# EAGLE schematic Arctos 65 V1 (EAGLE 9.6.2)
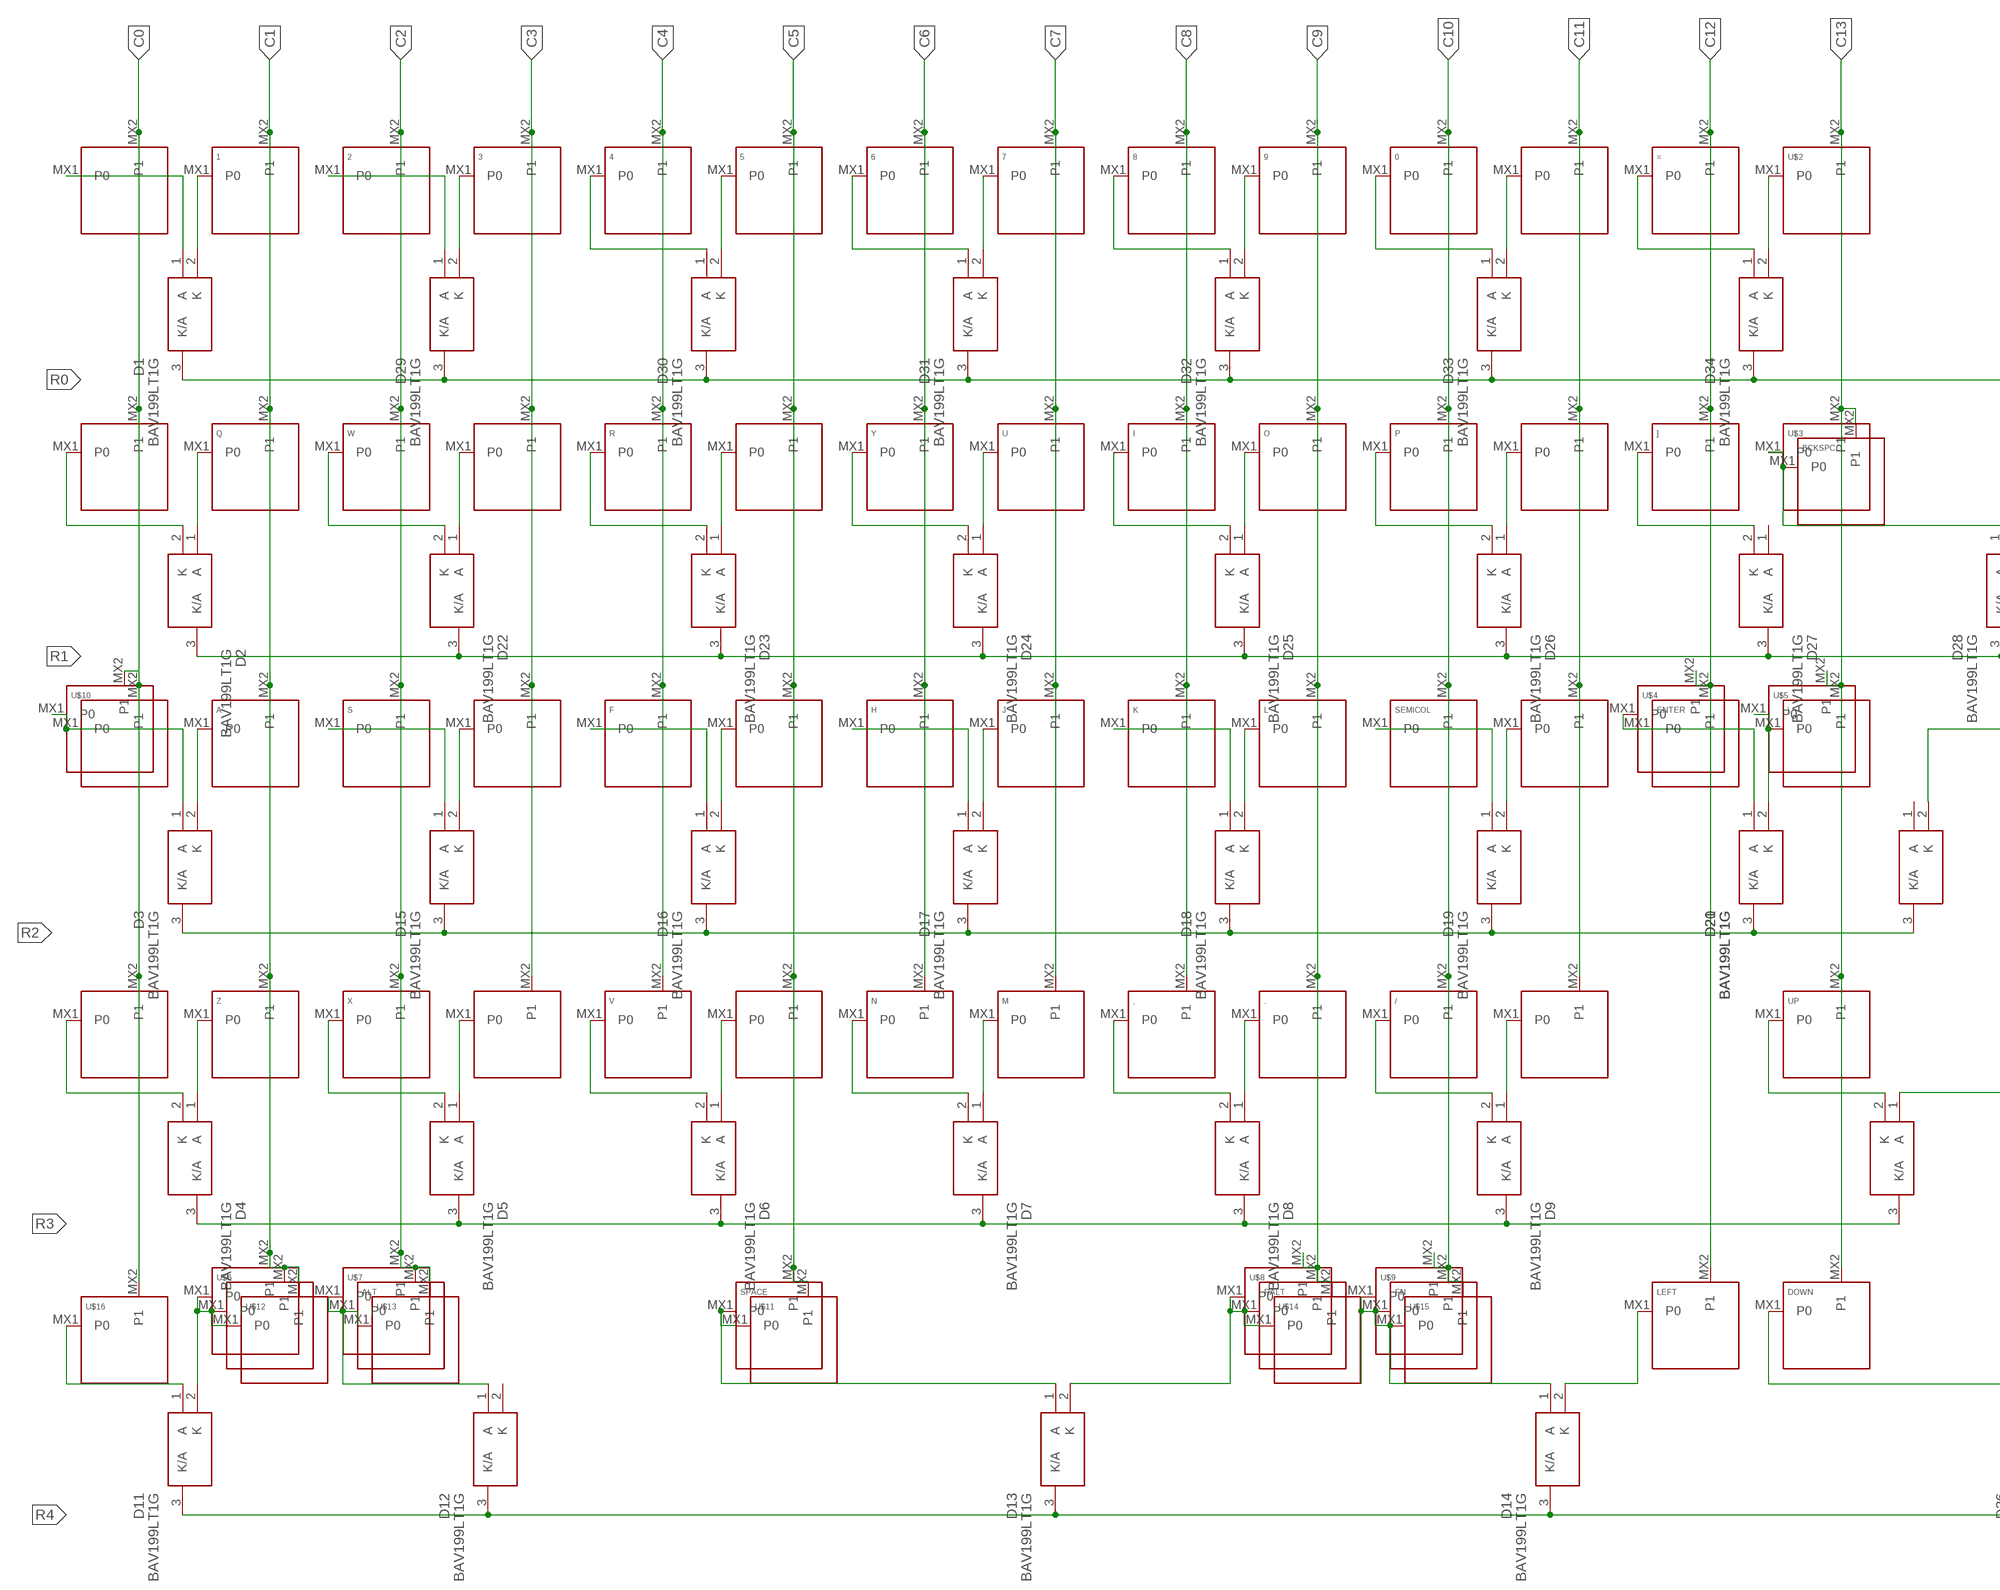
[diagram p0: schematic, sheet 1, part 1 of 2]
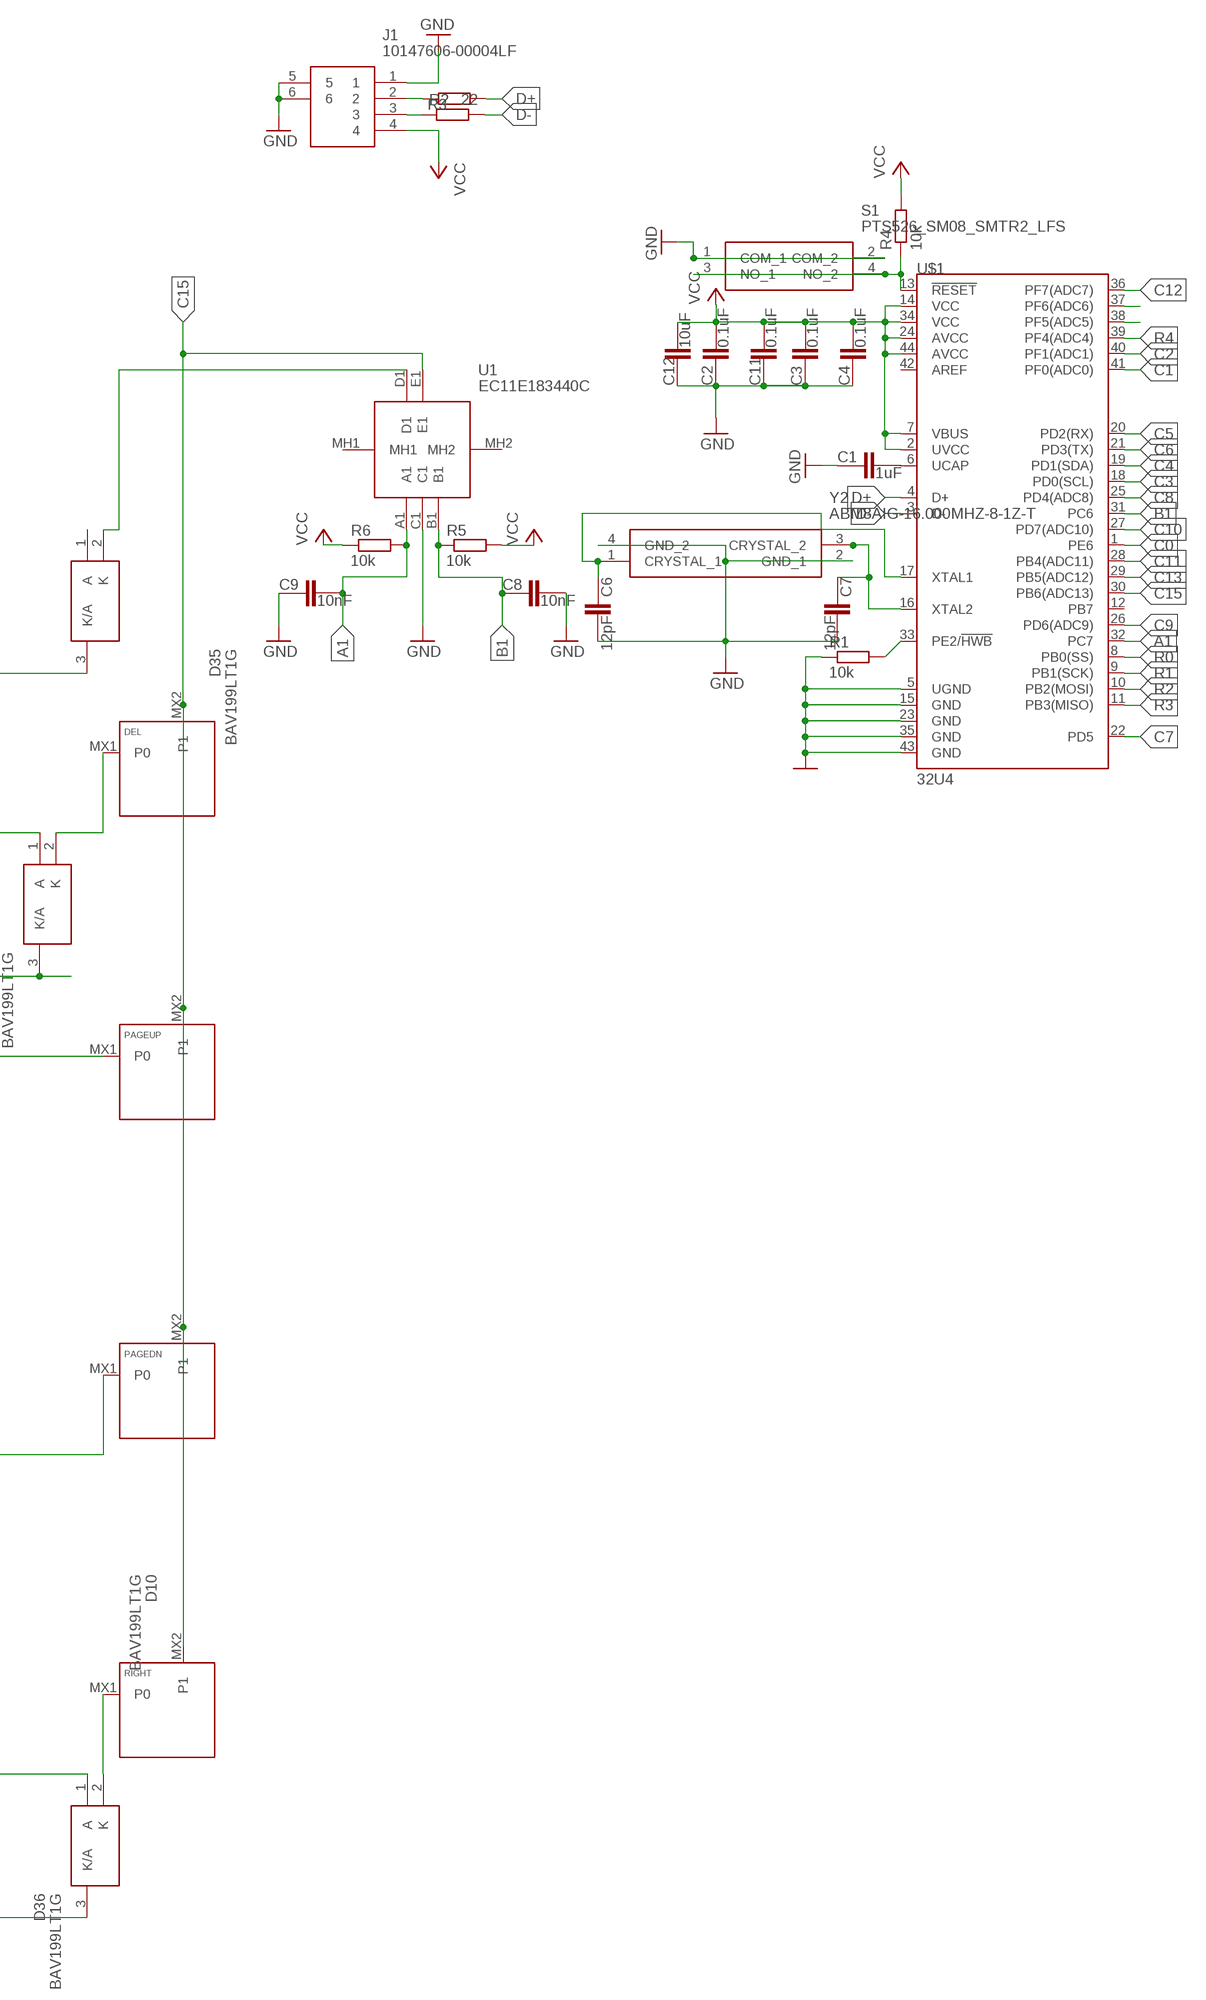
[diagram p1: schematic, sheet 1, part 2 of 2]

## Parts
0  KEYSWITCH-PLAIN-MX-1U  [MX-1U]
1  KEYSWITCH-PLAIN-MX-1U  [MX-1U]
2  KEYSWITCH-PLAIN-MX-1U  [MX-1U]
3  KEYSWITCH-PLAIN-MX-1U  [MX-1U]
4  KEYSWITCH-PLAIN-MX-1U  [MX-1U]
5  KEYSWITCH-PLAIN-MX-1U  [MX-1U]
6  KEYSWITCH-PLAIN-MX-1U  [MX-1U]
7  KEYSWITCH-PLAIN-MX-1U  [MX-1U]
8  KEYSWITCH-PLAIN-MX-1U  [MX-1U]
9  KEYSWITCH-PLAIN-MX-1U  [MX-1U]
'  KEYSWITCH-PLAIN-MX-1U  [MX-1U]
,  KEYSWITCH-PLAIN-MX-1U  [MX-1U]
-  KEYSWITCH-PLAIN-MX-1U  [MX-1U]
.  KEYSWITCH-PLAIN-MX-1U  [MX-1U]
/  KEYSWITCH-PLAIN-MX-1U  [MX-1U]
=  KEYSWITCH-PLAIN-MX-1U  [MX-1U]
[  KEYSWITCH-PLAIN-MX-1U  [MX-1U]
\  KEYSWITCH-PLAIN-MX-1U  [MX-1U]
]  KEYSWITCH-PLAIN-MX-1U  [MX-1U]
A  KEYSWITCH-PLAIN-MX-1U  [MX-1U]
ALT  KEYSWITCH-PLAIN-MX-1U  [MX-1U]
B  KEYSWITCH-PLAIN-MX-1U  [MX-1U]
BCKSPC  KEYSWITCH-PLAIN-MX-2U  [MX-2U]
C  KEYSWITCH-PLAIN-MX-1U  [MX-1U]
C1  1uF  CAPACITOR-0603  [C0603]
C2  0.1uF  CAPACITOR-0603  [C0603]
C3  0.1uF  CAPACITOR-0603  [C0603]
C4  0.1uF  CAPACITOR-0603  [C0603]
C6  12pF  CAPACITOR-0603  [C0603]
C7  12pF  CAPACITOR-0603  [C0603]
C8  10nF  CAPACITOR-0603  [C0603]
C9  10nF  CAPACITOR-0603  [C0603]
C11  0.1uF  CAPACITOR-0603  [C0603]
C12  10uF  CAPACITOR-0603  [C0603]
CAPS  KEYSWITCH-PLAIN-MX-1U  [MX-1U]
D  KEYSWITCH-PLAIN-MX-1U  [MX-1U]
D1  BAV199LT1G  [SOT96P237X111-3N]
D2  BAV199LT1G  [SOT96P237X111-3N]
D3  BAV199LT1G  [SOT96P237X111-3N]
D4  BAV199LT1G  [SOT96P237X111-3N]
D5  BAV199LT1G  [SOT96P237X111-3N]
D6  BAV199LT1G  [SOT96P237X111-3N]
D7  BAV199LT1G  [SOT96P237X111-3N]
D8  BAV199LT1G  [SOT96P237X111-3N]
D9  BAV199LT1G  [SOT96P237X111-3N]
D10  BAV199LT1G  [SOT96P237X111-3N]
D11  BAV199LT1G  [SOT96P237X111-3N]
D12  BAV199LT1G  [SOT96P237X111-3N]
D13  BAV199LT1G  [SOT96P237X111-3N]
D14  BAV199LT1G  [SOT96P237X111-3N]
D15  BAV199LT1G  [SOT96P237X111-3N]
D16  BAV199LT1G  [SOT96P237X111-3N]
D17  BAV199LT1G  [SOT96P237X111-3N]
D18  BAV199LT1G  [SOT96P237X111-3N]
D19  BAV199LT1G  [SOT96P237X111-3N]
D20  BAV199LT1G  [SOT96P237X111-3N]
D21  BAV199LT1G  [SOT96P237X111-3N]
D22  BAV199LT1G  [SOT96P237X111-3N]
D23  BAV199LT1G  [SOT96P237X111-3N]
D24  BAV199LT1G  [SOT96P237X111-3N]
D25  BAV199LT1G  [SOT96P237X111-3N]
D26  BAV199LT1G  [SOT96P237X111-3N]
D27  BAV199LT1G  [SOT96P237X111-3N]
D28  BAV199LT1G  [SOT96P237X111-3N]
D29  BAV199LT1G  [SOT96P237X111-3N]
D30  BAV199LT1G  [SOT96P237X111-3N]
D31  BAV199LT1G  [SOT96P237X111-3N]
D32  BAV199LT1G  [SOT96P237X111-3N]
D33  BAV199LT1G  [SOT96P237X111-3N]
D34  BAV199LT1G  [SOT96P237X111-3N]
D35  BAV199LT1G  [SOT96P237X111-3N]
D36  BAV199LT1G  [SOT96P237X111-3N]
DEL  KEYSWITCH-PLAIN-MX-1U  [MX-1U]
DOWN  KEYSWITCH-PLAIN-MX-1U  [MX-1U]
E  KEYSWITCH-PLAIN-MX-1U  [MX-1U]
ENTER  KEYSWITCH-PLAIN-MX-2U  [MX-2U]
ESC  KEYSWITCH-PLAIN-MX-1U  [MX-1U]
F  KEYSWITCH-PLAIN-MX-1U  [MX-1U]
FN  KEYSWITCH-PLAIN-MX-1U  [MX-1U]
G  KEYSWITCH-PLAIN-MX-1U  [MX-1U]
H  KEYSWITCH-PLAIN-MX-1U  [MX-1U]
I  KEYSWITCH-PLAIN-MX-1U  [MX-1U]
J  KEYSWITCH-PLAIN-MX-1U  [MX-1U]
J1  10147606-00004LF  [1014760600004LF]
K  KEYSWITCH-PLAIN-MX-1U  [MX-1U]
L  KEYSWITCH-PLAIN-MX-1U  [MX-1U]
LEFT  KEYSWITCH-PLAIN-MX-1U  [MX-1U]
M  KEYSWITCH-PLAIN-MX-1U  [MX-1U]
N  KEYSWITCH-PLAIN-MX-1U  [MX-1U]
O  KEYSWITCH-PLAIN-MX-1U  [MX-1U]
P  KEYSWITCH-PLAIN-MX-1U  [MX-1U]
PAGEDN  KEYSWITCH-PLAIN-MX-1U  [MX-1U]
PAGEUP  KEYSWITCH-PLAIN-MX-1U  [MX-1U]
Q  KEYSWITCH-PLAIN-MX-1U  [MX-1U]
R  KEYSWITCH-PLAIN-MX-1U  [MX-1U]
R1  10k  RESISTOR-0603  [R0603]
R2  22  RESISTOR-0603  [R0603]
R3  22  RESISTOR-0603  [R0603]
R4  10k  RESISTOR-0603  [R0603]
R5  10k  RESISTOR-0603  [R0603]
R6  10k  RESISTOR-0603  [R0603]
RALT  KEYSWITCH-PLAIN-MX-1U  [MX-1U]
RIGHT  KEYSWITCH-PLAIN-MX-1U  [MX-1U]
RSHIFT  KEYSWITCH-PLAIN-MX-1U  [MX-1U]
S  KEYSWITCH-PLAIN-MX-1U  [MX-1U]
S1  PTS526_SM08_SMTR2_LFS  [PTS526SM08SMTR2LFS]
SEMICOL  KEYSWITCH-PLAIN-MX-1U  [MX-1U]
SHIFT  KEYSWITCH-PLAIN-MX-2U  [MX-2U]
SPACE  KEYSWITCH-PLAIN-MX-7U-FLIPPED  [MX-7U-FLIPPED]
T  KEYSWITCH-PLAIN-MX-1U  [MX-1U]
TAB  KEYSWITCH-PLAIN-MX-1U  [MX-1U]
U  KEYSWITCH-PLAIN-MX-1U  [MX-1U]
U1  EC11E183440C  [EC11E183440C]
U$1  32U4  ATMEGA32U4TQFP-44  [TQFP44]
U$2  KEYSWITCH-PLAIN-MX-1U  [MX-1U]
U$3  KEYSWITCH-PLAIN-MX-1U  [MX-1U]
U$4  KEYSWITCH-PLAIN-MX-1U  [MX-1U]
U$5  KEYSWITCH-PLAIN-MX-2U-ROTATED  [MX-2U-ROTATED]
U$6  KEYSWITCH-PLAIN-MX-1U  [MX-1U]
U$7  KEYSWITCH-PLAIN-MX-1U  [MX-1U]
U$8  KEYSWITCH-PLAIN-MX-1U  [MX-1U]
U$9  KEYSWITCH-PLAIN-MX-1U  [MX-1U]
U$10  KEYSWITCH-PLAIN-MX-1U  [MX-1U]
U$11  KEYSWITCH-PLAIN-MX-6.25U-FLIPPED  [MX-6.25U-FLIPPED]
U$12  KEYSWITCH-PLAIN-MX-1U  [MX-1U]
U$13  KEYSWITCH-PLAIN-MX-1U  [MX-1U]
U$14  KEYSWITCH-PLAIN-MX-1U  [MX-1U]
U$15  KEYSWITCH-PLAIN-MX-1U  [MX-1U]
U$16  KEYSWITCH-PLAIN-MX-1U  [MX-1U]
UP  KEYSWITCH-PLAIN-MX-1U  [MX-1U]
V  KEYSWITCH-PLAIN-MX-1U  [MX-1U]
W  KEYSWITCH-PLAIN-MX-1U  [MX-1U]
WIN  KEYSWITCH-PLAIN-MX-1U  [MX-1U]
X  KEYSWITCH-PLAIN-MX-1U  [MX-1U]
Y  KEYSWITCH-PLAIN-MX-1U  [MX-1U]
Y2  ABM8AIG-16.000MHZ-8-1Z-T  [ABM8AIG16000MHZ81ZT]
Z  KEYSWITCH-PLAIN-MX-1U  [MX-1U]

## Nets
A1: C9.2 R6.2 U1.A1 U$1.32(PC7)
B1: C8.1 R5.1 U1.B1 U$1.31(PC6)
C0: CAPS.MX2(P1) ESC.MX2(P1) SHIFT.MX2(P1) TAB.MX2(P1) U$1.1(PE6) U$10.MX2(P1) U$16.MX2(P1)
C1: 1.MX2(P1) A.MX2(P1) Q.MX2(P1) U$1.41(PF0(ADC0)) U$6.MX2(P1) U$12.MX2(P1) WIN.MX2(P1) Z.MX2(P1)
C2: 2.MX2(P1) ALT.MX2(P1) S.MX2(P1) U$1.40(PF1(ADC1)) U$7.MX2(P1) U$13.MX2(P1) W.MX2(P1) X.MX2(P1)
C3: 3.MX2(P1) C.MX2(P1) D.MX2(P1) E.MX2(P1) U$1.18(PD0(SCL))
C4: 4.MX2(P1) F.MX2(P1) R.MX2(P1) U$1.19(PD1(SDA)) V.MX2(P1)
C5: 5.MX2(P1) B.MX2(P1) G.MX2(P1) SPACE.MX2(P1) T.MX2(P1) U$1.20(PD2(RX)) U$11.MX2(P1)
C6: 6.MX2(P1) H.MX2(P1) N.MX2(P1) U$1.21(PD3(TX)) Y.MX2(P1)
C7: 7.MX2(P1) J.MX2(P1) M.MX2(P1) U$1.22(PD5) U.MX2(P1)
C8: 8.MX2(P1) ,.MX2(P1) I.MX2(P1) K.MX2(P1) U$1.25(PD4(ADC8))
C9: 9.MX2(P1) ..MX2(P1) L.MX2(P1) O.MX2(P1) RALT.MX2(P1) U$1.26(PD6(ADC9)) U$8.MX2(P1) U$14.MX2(P1)
C10: 0.MX2(P1) /.MX2(P1) FN.MX2(P1) P.MX2(P1) SEMICOL.MX2(P1) U$1.27(PD7(ADC10)) U$9.MX2(P1) U$15.MX2(P1)
C11: '.MX2(P1) -.MX2(P1) [.MX2(P1) RSHIFT.MX2(P1) U$1.28(PB4(ADC11))
C12: =.MX2(P1) ].MX2(P1) ENTER.MX2(P1) LEFT.MX2(P1) U$1.36(PF7(ADC7)) U$4.MX2(P1)
C13: \.MX2(P1) BCKSPC.MX2(P1) DOWN.MX2(P1) U$1.29(PB5(ADC12)) U$2.MX2(P1) U$3.MX2(P1) U$5.MX2(P1) UP.MX2(P1)
C15: DEL.MX2(P1) PAGEDN.MX2(P1) PAGEUP.MX2(P1) RIGHT.MX2(P1) U1.E1 U$1.30(PB6(ADC13))
D+: R3.2 U$1.4(D+)
D-: R2.2 U$1.3(D-)
GND: C1.1 C2.1 C3.1 C4.1 C6.2 C7.2 C8.2 C9.1 C11.1 C12.1 J1.1 J1.5 J1.6 R1.1 S1.1(COM_1) S1.2(COM_2) U1.C1 U$1.5(UGND) U$1.15(GND) U$1.23(GND) U$1.35(GND) U$1.43(GND) Y2.2(GND_1) Y2.4(GND_2)
N$1: D28.2(K) DEL.MX1(P0)
N$2: A.MX1(P0) D3.2(K)
N$3: D20.1(A) ENTER.MX1(P0) U$4.MX1(P0)
N$4: D11.2(K) U$6.MX1(P0) U$12.MX1(P0) WIN.MX1(P0)
N$5: ALT.MX1(P0) D12.1(A) U$7.MX1(P0) U$13.MX1(P0)
N$6: D13.2(K) RALT.MX1(P0) U$8.MX1(P0) U$14.MX1(P0)
N$7: D14.1(A) FN.MX1(P0) U$9.MX1(P0) U$15.MX1(P0)
N$8: D11.1(A) U$16.MX1(P0)
N$9: D1.1(A) ESC.MX1(P0)
N$10: 1.MX1(P0) D1.2(K)
N$11: D2.2(K) TAB.MX1(P0)
N$12: D2.1(A) Q.MX1(P0)
N$13: 2.MX1(P0) D29.1(A)
N$14: 3.MX1(P0) D29.2(K)
N$17: 4.MX1(P0) D30.1(A)
N$18: 5.MX1(P0) D30.2(K)
N$19: 6.MX1(P0) D31.1(A)
N$20: 7.MX1(P0) D31.2(K)
N$21: 8.MX1(P0) D32.1(A)
N$22: 9.MX1(P0) D32.2(K)
N$23: 0.MX1(P0) D33.1(A)
N$24: -.MX1(P0) D33.2(K)
N$25: =.MX1(P0) D34.1(A)
N$26: D34.2(K) U$2.MX1(P0)
N$27: D22.2(K) W.MX1(P0)
N$28: D22.1(A) E.MX1(P0)
N$29: D23.2(K) R.MX1(P0)
N$30: D23.1(A) T.MX1(P0)
N$31: D24.2(K) Y.MX1(P0)
N$32: D24.1(A) U.MX1(P0)
N$33: D25.2(K) I.MX1(P0)
N$34: D25.1(A) O.MX1(P0)
N$35: D26.2(K) P.MX1(P0)
N$36: [.MX1(P0) D26.1(A)
N$37: ].MX1(P0) D27.2(K)
N$40: D15.1(A) S.MX1(P0)
N$41: D35.2(K) U1.D1
N$42: D15.2(K) D.MX1(P0)
N$43: D16.1(A) F.MX1(P0)
N$44: CAPS.MX1(P0) D3.1(A) U$10.MX1(P0)
N$45: D16.2(K) G.MX1(P0)
N$46: D17.1(A) H.MX1(P0)
N$47: D17.2(K) J.MX1(P0)
N$48: D18.1(A) K.MX1(P0)
N$49: D18.2(K) L.MX1(P0)
N$50: D19.1(A) SEMICOL.MX1(P0)
N$51: '.MX1(P0) D19.2(K)
N$52: \.MX1(P0) D20.2(K) U$5.MX1(P0)
N$53: D4.2(K) SHIFT.MX1(P0)
N$54: D4.1(A) Z.MX1(P0)
N$55: D5.2(K) X.MX1(P0)
N$56: C.MX1(P0) D5.1(A)
N$57: D6.2(K) V.MX1(P0)
N$58: B.MX1(P0) D6.1(A)
N$59: D7.2(K) N.MX1(P0)
N$60: D7.1(A) M.MX1(P0)
N$61: ,.MX1(P0) D8.2(K)
N$62: ..MX1(P0) D8.1(A)
N$63: /.MX1(P0) D9.2(K)
N$64: D9.1(A) RSHIFT.MX1(P0)
N$65: D10.2(K) UP.MX1(P0)
N$66: J1.2 R3.1
N$67: R1.2 U$1.33(PE2/!HWB)
N$68: J1.3 R2.1
N$70: C1.2 U$1.6(UCAP)
N$71: C6.1 U$1.17(XTAL1) Y2.1(CRYSTAL_1)
N$72: BCKSPC.MX1(P0) D28.1(A) U$3.MX1(P0)
N$74: D21.2(K) PAGEUP.MX1(P0)
N$75: D10.1(A) PAGEDN.MX1(P0)
N$76: D13.1(A) SPACE.MX1(P0) U$11.MX1(P0)
N$77: D14.2(K) LEFT.MX1(P0)
N$78: D36.1(A) DOWN.MX1(P0)
N$79: D36.2(K) RIGHT.MX1(P0)
N$80: C7.1 U$1.16(XTAL2) Y2.3(CRYSTAL_2)
N$81: R4.1 S1.3(NO_1) S1.4(NO_2) U$1.13(!RESET)
N$97: U$1.38(PF5(ADC5))
N$98: U$1.37(PF6(ADC6))
R0: D1.3(K/A) D29.3(K/A) D30.3(K/A) D31.3(K/A) D32.3(K/A) D33.3(K/A) D34.3(K/A) D35.3(K/A) U$1.8(PB0(SS))
R1: D2.3(K/A) D22.3(K/A) D23.3(K/A) D24.3(K/A) D25.3(K/A) D26.3(K/A) D27.3(K/A) D28.3(K/A) U$1.9(PB1(SCK))
R2: D3.3(K/A) D15.3(K/A) D16.3(K/A) D17.3(K/A) D18.3(K/A) D19.3(K/A) D20.3(K/A) D21.3(K/A) U$1.10(PB2(MOSI))
R3: D4.3(K/A) D5.3(K/A) D6.3(K/A) D7.3(K/A) D8.3(K/A) D9.3(K/A) D10.3(K/A) U$1.11(PB3(MISO))
R4: D11.3(K/A) D12.3(K/A) D13.3(K/A) D14.3(K/A) D36.3(K/A) U$1.39(PF4(ADC4))
VCC: C2.2 C3.2 C4.2 C11.2 C12.2 J1.4 R4.2 R5.2 R6.1 U$1.2(UVCC) U$1.7(VBUS) U$1.14(VCC) U$1.24(AVCC) U$1.34(VCC) U$1.44(AVCC)
Unconnected: D12.2(K) D21.1(A) D27.1(A) D35.1(A) U1.MH1 U1.MH2 U$1.12(PB7) U$1.42(AREF)

## Library data of the parts
0 1-9 ' , - . / = [ \ ] A ALT B BCKSPC C CAPS D DEL DOWN E ENTER ESC F FN G H I J K L LEFT M N O P PAGEDN PAGEUP Q R RALT RIGHT RSHIFT S SEMICOL SHIFT SPACE T TAB U U$2-U$16 UP V W WIN X Y Z = Keyboard:KEYSWITCH-PLAIN
C1-C4 C6-C9 C11 C12 = Components:CAPACITOR
D1-D36 = SamacSys_Parts:BAV199LT1G: Dual Series Switch.Diode 70V 715mA SOT23 ON Semiconductor BAV199LT1G Fast Rectifier Diode, 215mA DC, 70V dc, 3us, 3-Pin SOT-23 Source: Datasheet <http://www.onsemi.com/pub/Collateral/BAV199LT1-D.PDF>; DESCRIPTION: Dual Series Switch.Diode 70V 715mA SOT23 ON Semiconductor BAV199LT1G Fast Rectifier Diode, 215mA DC, 70V dc, 3us, 3-Pin SOT-23; HEIGHT: 1.11mm; MANUFACTURER_NAME: ON Semiconductor; MANUFACTURER_PART_NUMBER: BAV199LT1G; MOUSER_PART_NUMBER: 863-BAV199LT1G; MOUSER_PRICE-STOCK: https://www.mouser.co.uk/ProductDetail/ON-Semiconductor/BAV199LT1G?qs=vLkC5FC1VN%2Fyd%252BQbk7oQjw%3D%3D
J1 = SamacSys_Parts:10147606-00004LF: Headers & Wire Housings R/A SMT Header Source: Datasheet <https://cdn.amphenol-icc.com/media/wysiwyg/files/drawing/10147606.pdf>; DESCRIPTION: Headers & Wire Housings R/A SMT Header; HEIGHT: 3.1mm; MANUFACTURER_NAME: Amphenol; MANUFACTURER_PART_NUMBER: 10147606-00004LF; MOUSER_PART_NUMBER: 649-10147606-00004LF; MOUSER_PRICE-STOCK: https://www.mouser.co.uk/ProductDetail/Amphenol-FCI/10147606-00004LF?qs=w%2Fv1CP2dgqrztttIAfWk1w%3D%3D
R1-R6 = Components:RESISTOR
S1 = SamacSys_Parts:PTS526_SM08_SMTR2_LFS: Tactile Switches 50mA 12VDC, 5.2x5.2mm, 0.8mm H, 160gf, G leads, No ground pin, no actuator Source: Datasheet <https://www.arrow.com/en/products/pts526-sm08-smtr2-lfs/ck>; DESCRIPTION: Tactile Switches 50mA 12VDC, 5.2x5.2mm, 0.8mm H, 160gf, G leads, No ground pin, no actuator; HEIGHT: 0.95mm; MANUFACTURER_NAME: C & K COMPONENTS; MANUFACTURER_PART_NUMBER: PTS526 SM08 SMTR2 LFS; MOUSER_PART_NUMBER: 611-PTS526SM08SMTR2L; MOUSER_PRICE-STOCK: https://www.mouser.co.uk/ProductDetail/CK/PTS526-SM08-SMTR2-LFS?qs=UXgszm6BlbFgRZzlfGAMFg%3D%3D
U1 = SamacSys_Parts:EC11E183440C: Alps 18 Pulse Incremental Mechanical Rotary Encoder with a 6 mm Flat Shaft (Not Indexed), Through Hole Source: Datasheet <https://www.alps.com/prod/info/E/HTML/Encoder/Incremental/EC11/EC11E183440C.html>; ARROW_PART_NUMBER: EC11E183440C; DESCRIPTION: Alps 18 Pulse Incremental Mechanical Rotary Encoder with a 6 mm Flat Shaft (Not Indexed), Through Hole; HEIGHT: 24.5mm; MANUFACTURER_NAME: ALPS; MANUFACTURER_PART_NUMBER: EC11E183440C; MOUSER_PART_NUMBER: 688-EC11E183440C; MOUSER_PRICE-STOCK: https://www.mouser.co.uk/ProductDetail/ALPS/EC11E183440C?qs=YMSFtX0bdJC6PoDF7K4k%252Bg%3D%3D
U$1 = SparkFun-IC-Microcontroller:ATMEGA32U4: Atmel MCU, 32KByte Atmel 44-pin 8-bit Microcontroller with 32KBytes of ISP Flash and USB Controller Datasheet <http://cdn.sparkfun.com/datasheets/Dev/Arduino/Boards/ATMega32U4.pdf> SparkFun Products LilyPad Arduino USB - ATmega32U4 Board <https://www.sparkfun.com/products/12049> (DEV-12049) Pro Micro - 5V/16MHz <https://www.sparkfun.com/products/12640> (DEV-12640) Pro Micro - 3.3V/8MHz <https://www.sparkfun.com/products/12587> (DEV-12587) Fio v3 - ATmega32U4 <https://www.sparkfun.com/products/11520> (DEV-11520) Qduino Mini <https://www.sparkfun.com/products/13614> (DEV-13614) Makey Makey - Standard Kit <https://www.sparkfun.com/products/11511> (WIG-11511) Makey Makey Deluxe Kit <https://www.sparkfun.com/products/11519> (WIG-11519); PROD_ID: IC-11161
Y2 = SamacSys_Parts:ABM8AIG-16.000MHZ-8-1Z-T: Crystals 8pF 16MHz 10ppm AEC-Q200 -40C +125C Source: Datasheet <https://componentsearchengine.com//ABM8AIG-16.000MHZ-8-1Z-T.pdf>; DESCRIPTION: Crystals 8pF 16MHz 10ppm AEC-Q200 -40C +125C; HEIGHT: 0.8mm; MANUFACTURER_NAME: ABRACON; MANUFACTURER_PART_NUMBER: ABM8AIG-16.000MHZ-8-1Z-T; MOUSER_PART_NUMBER: 815-M8AIG-16-8-1ZT; MOUSER_PRICE-STOCK: https://www.mouser.co.uk/ProductDetail/ABRACON/ABM8AIG-16000MHZ-8-1Z-T?qs=uwxL4vQweFMHB3E%252BbhZCZA%3D%3D